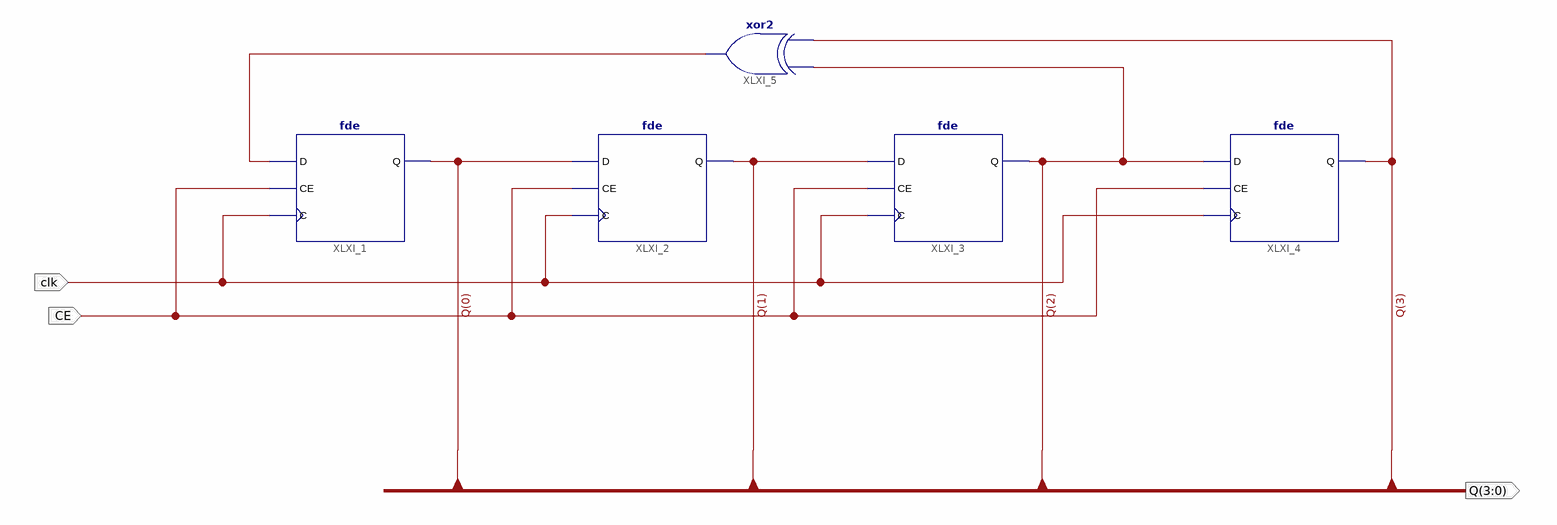
[diagram p0: schematic sheet 1]
// Xilinx ISE schematic RDM.sch (spartan6) as structural Verilog: 5 symbols, 3 ports
module RDM (
  input  CE,
  input  clk,
  output [3:0] Q
);

  wire XLXN_15;

  fde #(.INIT("1")) XLXI_1 (.C(clk), .CE(CE), .D(XLXN_15), .Q(Q[0]));
  fde XLXI_2 (.C(clk), .CE(CE), .D(Q[0]), .Q(Q[1]));
  fde XLXI_3 (.C(clk), .CE(CE), .D(Q[1]), .Q(Q[2]));
  fde XLXI_4 (.C(clk), .CE(CE), .D(Q[2]), .Q(Q[3]));
  xor XLXI_5 (XLXN_15, Q[3], Q[2]);
endmodule
